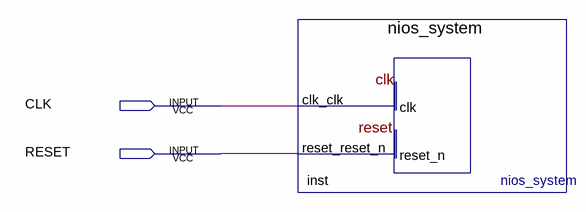
[diagram p0: schematic sheet]
// Quartus schematic Lab5Design.bdf as structural Verilog: 1 symbols, 2 pins
module Lab5Design (
  input  CLK,
  input  RESET
);

  nios_system inst (.clk_clk(CLK), .reset_reset_n(RESET));
endmodule
